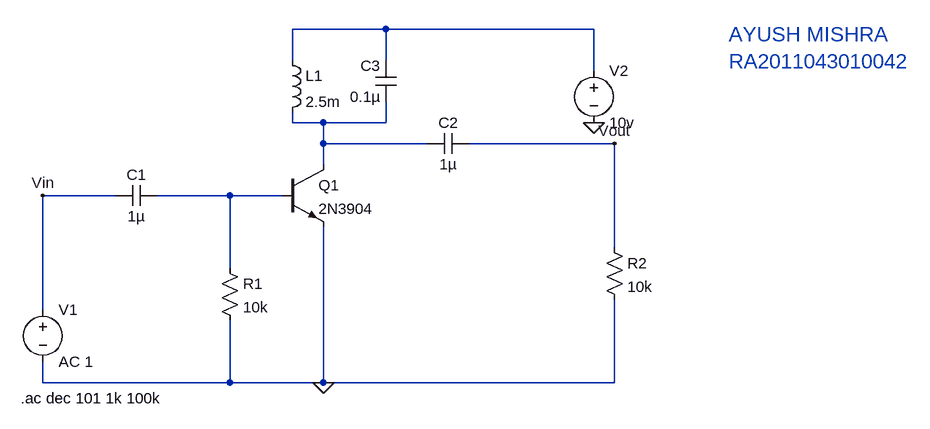
[diagram p0: schematic exp 5a.asc]
exp 5a.asc, the LTspice schematic file:
Version 4
SHEET 1 1164 680
WIRE 336 -128 192 -128
WIRE 656 -128 336 -128
WIRE 192 -80 192 -128
WIRE 336 -80 336 -128
WIRE 656 -64 656 -128
WIRE 192 16 192 0
WIRE 240 16 192 16
WIRE 336 16 336 -16
WIRE 336 16 240 16
WIRE 240 48 240 16
WIRE 400 48 240 48
WIRE 688 48 464 48
WIRE 240 80 240 48
WIRE -80 128 -192 128
WIRE 96 128 -16 128
WIRE 176 128 96 128
WIRE 688 208 688 48
WIRE 96 240 96 128
WIRE -192 304 -192 128
WIRE -192 416 -192 384
WIRE 96 416 96 320
WIRE 96 416 -192 416
WIRE 240 416 240 176
WIRE 240 416 96 416
WIRE 688 416 688 288
WIRE 688 416 240 416
FLAG 656 16 0
FLAG 240 416 0
FLAG -192 128 Vin
FLAG 688 48 Vout
SYMBOL npn 176 80 R0
SYMATTR InstName Q1
SYMATTR Value 2N3904
SYMBOL voltage -192 288 R0
WINDOW 123 0 0 Left 0
WINDOW 39 0 0 Left 0
SYMATTR InstName V1
SYMATTR Value AC 1
SYMBOL voltage 656 -80 R0
WINDOW 123 0 0 Left 0
WINDOW 39 0 0 Left 0
SYMATTR InstName V2
SYMATTR Value 10v
SYMBOL cap -16 112 R90
WINDOW 0 0 32 VBottom 2
WINDOW 3 32 32 VTop 2
SYMATTR InstName C1
SYMATTR Value 1µ
SYMBOL cap 464 32 R90
WINDOW 0 0 32 VBottom 2
WINDOW 3 32 32 VTop 2
SYMATTR InstName C2
SYMATTR Value 1µ
SYMBOL cap 352 -16 R180
WINDOW 0 24 56 Left 2
WINDOW 3 24 8 Left 2
SYMATTR InstName C3
SYMATTR Value 0.1µ
SYMBOL ind 176 -96 R0
SYMATTR InstName L1
SYMATTR Value 2.5m
SYMBOL res 80 224 R0
SYMATTR InstName R1
SYMATTR Value 10k
SYMBOL res 672 192 R0
SYMATTR InstName R2
SYMATTR Value 10k
TEXT -226 440 Left 2 !.ac dec 101 1k 100k
TEXT 864 -120 Left 3 ;AYUSH MISHRA\nRA2011043010042

The netlist it stands for:
* exp 5a.asc
Q1 N002 N003 0 0 2N3904
V1 Vin 0 AC 1
V2 N001 0 10v
C1 N003 Vin 1µ
C2 Vout N002 1µ
C3 N002 N001 0.1µ
L1 N001 N002 2.5m
R1 N003 0 10k
R2 Vout 0 10k
.model NPN NPN
.model PNP PNP
.lib standard.bjt
.ac dec 101 1k 100k
* AYUSH MISHRA
* RA2011043010042
.backanno
.end